# EAGLE design LB_BIT_o3_RGBLED-v02(rev1) (EAGLE 6.2)
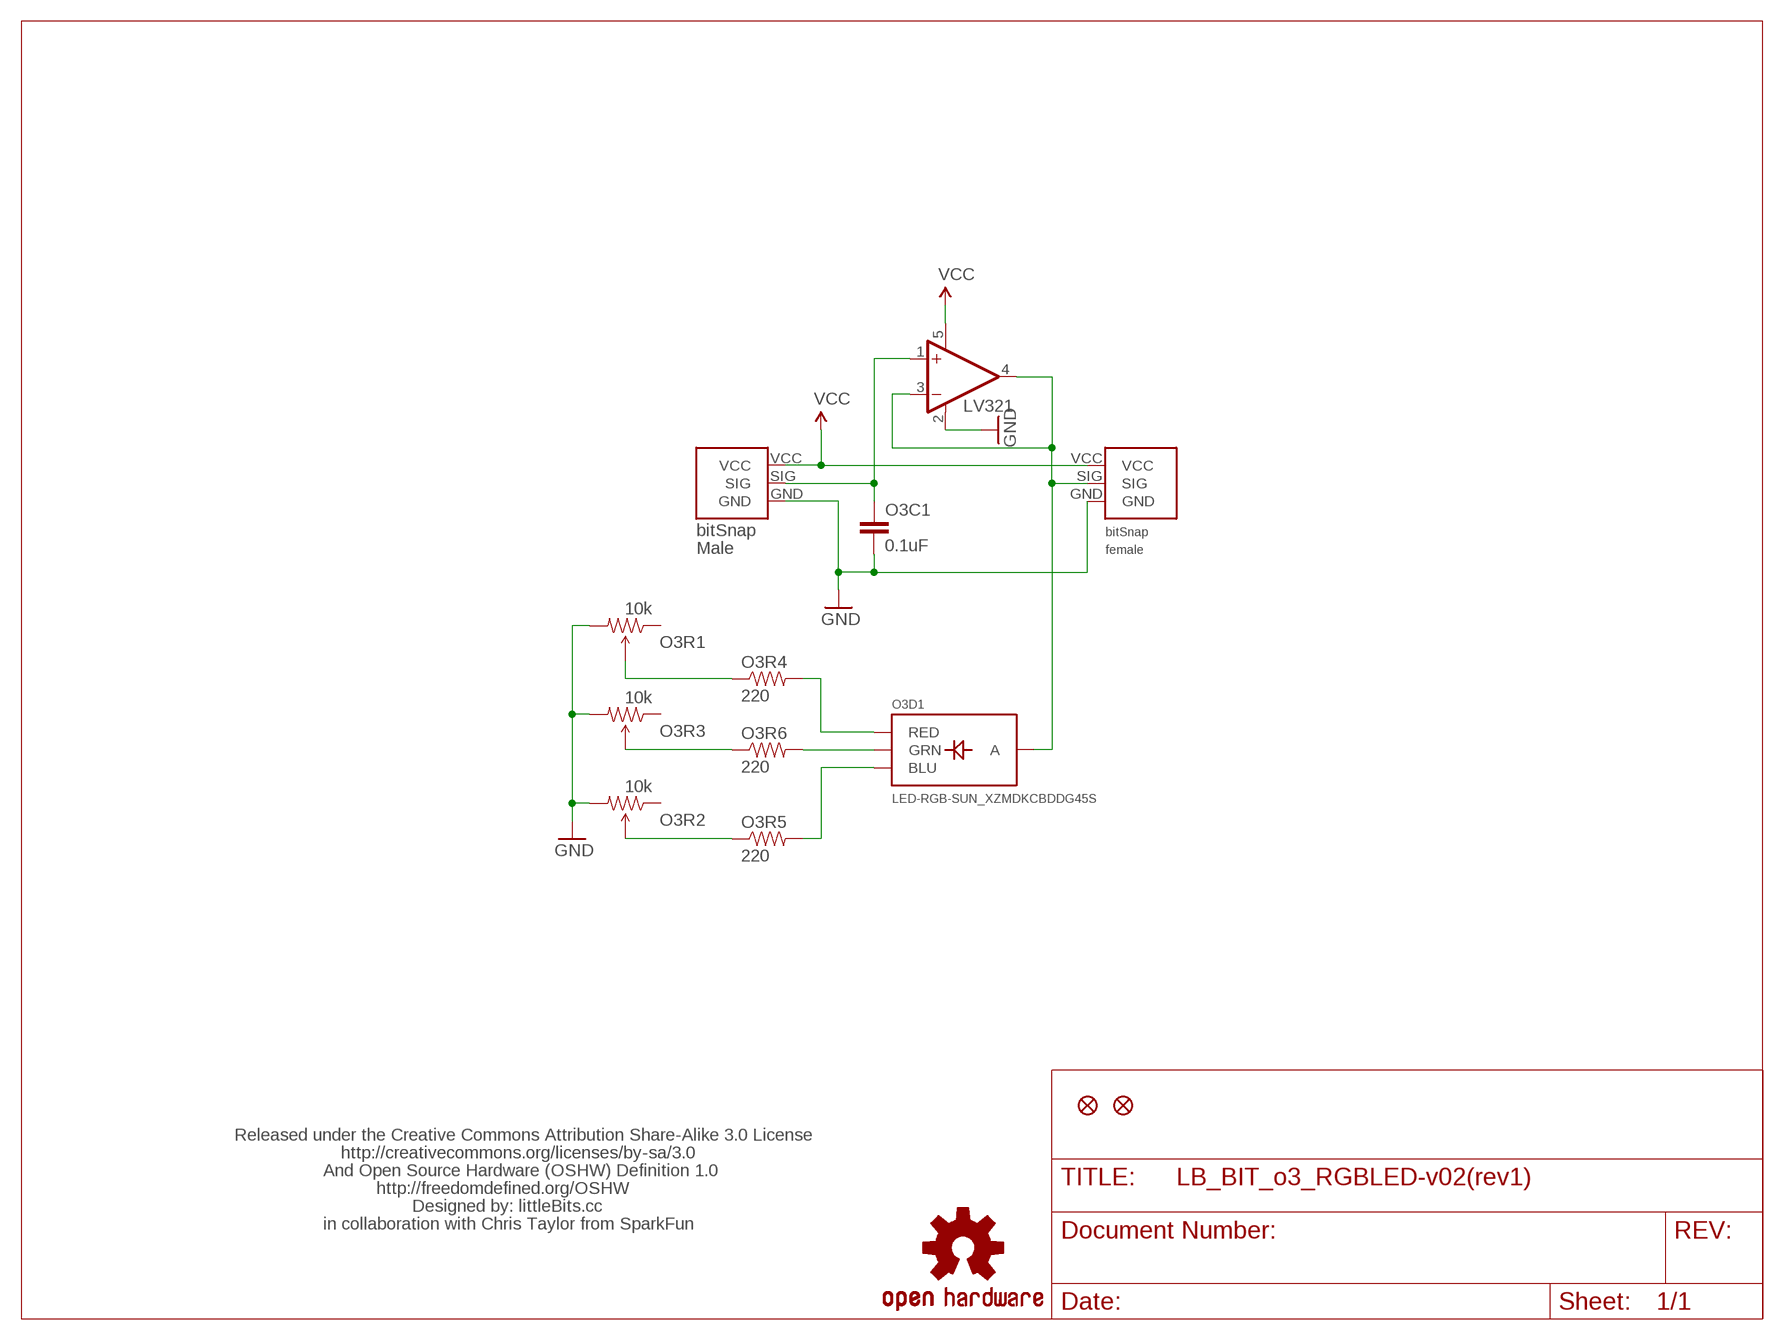
[diagram p0: schematic, sheet 1]

## Parts
JP1  FIDUCIAL1X2.5  [FIDUCIAL-1X2.5]
JP2  FIDUCIAL1X2.5  [FIDUCIAL-1X2.5]
O3BSF  BITSNAP_FEMALE  [BITSNAP_FEMALE]
O3BSM  BITSNAP_MALE  [BITSNAP_MALE]
O3C1  0.1uF  CAP0603-CAP  [0603-CAP]
O3D1  LED-RGB-SUN_XZMDKCBDDG45S  [LED-RGB-SUN_XZMDKCBDDG45S]
O3R1  10k  TRIMPOTSMD  [TRIMPOT-3MM]
O3R2  10k  TRIMPOTSMD  [TRIMPOT-3MM]
O3R3  10k  TRIMPOTSMD  [TRIMPOT-3MM]
O3R4  220  RESISTOR0603-RES  [0603-RES]
O3R5  220  RESISTOR0603-RES  [0603-RES]
O3R6  220  RESISTOR0603-RES  [0603-RES]
O3U1  LV321  [SC70]
U$1  LB_CREDITS  [OSHWCREDIT]
U$5  OSHW-LOGOL  [OSHW-LOGO-L]

## Nets
GND: O3BSF.GND O3BSM.GND O3C1.2 O3R1.3(CW) O3R2.3(CW) O3R3.3(CW) O3U1.2(V-)
LED: O3BSF.SIG O3D1.2(A) O3U1.3(-IN) O3U1.4(OUT)
N$1: O3R1.2(WIPER) O3R4.1
N$2: O3D1.1(RED) O3R4.2
N$3: O3D1.4(GRN) O3R6.2
N$4: O3D1.3(BLU) O3R5.2
N$5: O3R2.2(WIPER) O3R5.1
N$6: O3R3.2(WIPER) O3R6.1
SIG: O3BSM.SIG O3C1.1 O3U1.1(+IN)
VCC: O3BSF.VCC O3BSM.VCC O3U1.5(V+)
Unconnected: O3R1.1(CCW) O3R2.1(CCW) O3R3.1(CCW)

## Library data of the parts
JP1 JP2 = abes:FIDUCIAL: Fiducial Alignment Points Various fiducial points for machine vision alignment.
O3BSF = bitSnap:BITSNAP_FEMALE
O3BSM = bitSnap:BITSNAP_MALE
O3C1 = SparkFun:CAP: Capacitor Standard 0603 ceramic capacitor, and 0.1" leaded capacitor.
O3D1 = LITTLEBITS:LED-RGB-SUN_XZMDKCBDDG45S
O3R1-O3R3 = SparkFun:TRIMPOT
O3R4-O3R6 = SparkFun:RESISTOR: Resistor Basic schematic elements and footprints for 0603, 1206, and PTH 1/10th watt (small) resistors.
O3U1 = LITTLEBITS:LV321
U$1 = LITTLEBITS:LB_CREDITS
U$5 = SparkFun:OSHW-LOGO: Open Source Hardware Logo This logo indicates the piece of hardware it is found on incorporates a OSHW license and/or adheres to the definition of open source hardware found here: http://freedomdefined.org/OSHW

## Board
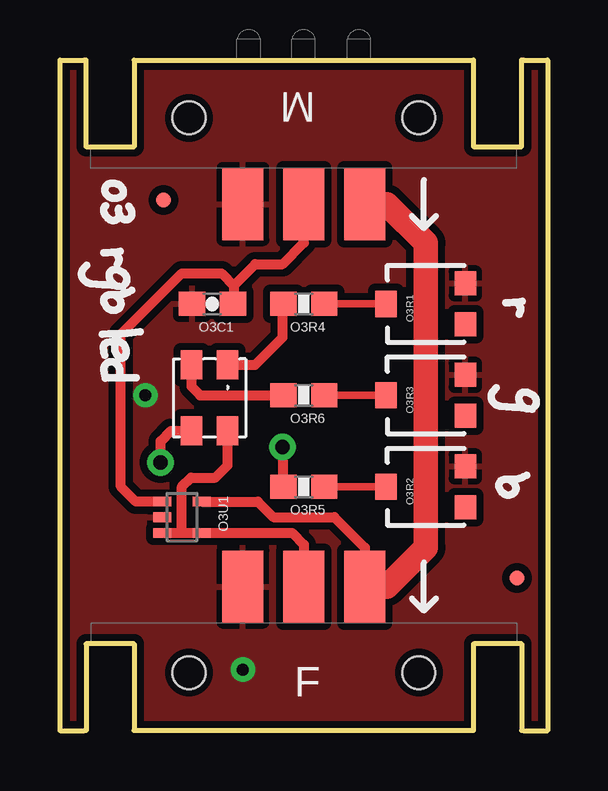
[diagram p1: board, top side]
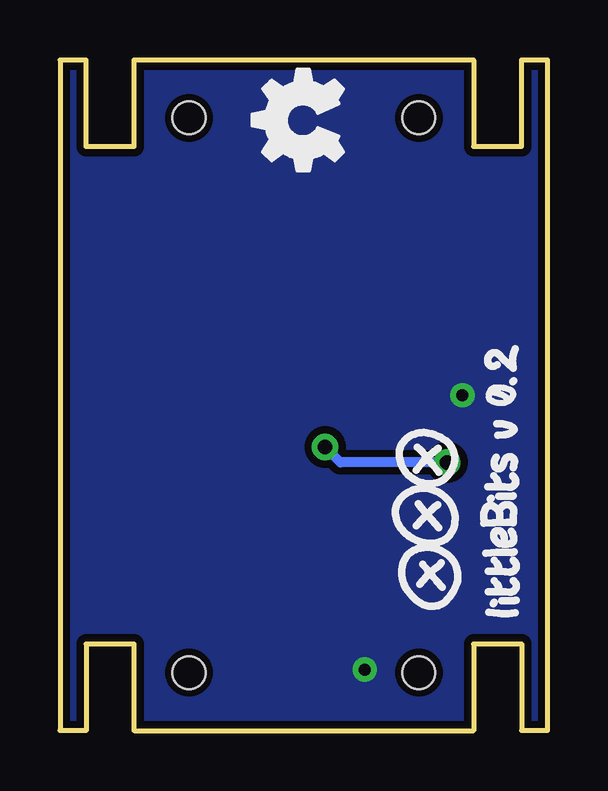
[diagram p2: board, bottom side, seen from below]

Size 20.32 x 27.94 mm. Coordinates in mm from the lower left corner, seen from the top.
Outline: 1.02,27.94 0,27.94 0,0 1.02,0
Outline: 19.3,27.94 20.32,27.94 20.32,0 19.3,0
Copper layers (1*16): Top 0.035mm / dielectric 1.5mm / Bottom 0.035mm
Design rules: minimum track width 8mil, minimum drill 20mil, track to track 8mil, track to pad 8mil, pad to pad 8mil, via to via 8mil, smd to smd 8mil, copper to edge 10mil, drill to drill 8mil, minimum pad ring 12mil, minimum via ring 10mil, stop-mask expansion 4mil, vias tented up to drill 25mil, thermal gap 10mil

### Footprints (pad centres in the part's own frame; a part is rotated, then mirrored left to right if it is on the bottom)
FIDUCIAL-1X2.5 = smd 0.635 x 0.635: 1 0,0
BITSNAP_FEMALE = smd 1.7 x 3: GND 6.35,6; SIG 8.89,6; VCC 11.43,6 | hole 1.37: 13.68,2.41; 4.1,2.41
BITSNAP_MALE = smd 1.7 x 3: GND 11.43,6; SIG 8.89,6; VCC 6.35,6 | hole 1.37: 13.68,2.41; 4.1,2.41
0603-CAP = smd 1.1 x 1: 1 -0.85,0; 2 0.85,0
LED-RGB-SUN_XZMDKCBDDG45S = smd 0.9 x 1.2: 1 0,0; 2 0,2.75; 3 1.5,2.75; 4 1.5,0; 5 1.5,2.75
TRIMPOT-3MM = smd 1 x 0.9: 1 -0.85,-1.65; 3 0.85,-1.65 | smd 1.1 x 0.9: 2 0,1.65
0603-RES = smd 1.1 x 1: 1 -0.85,0; 2 0.85,0
SC70 = smd 0.4 x 0.75: 1 -0.65,-0.825; 2 0,-0.825; 3 0.65,-0.825; 4 0.65,0.825; 5 -0.65,0.825

### Placement (x,y rotation side)
JP1  19.05,6.35 0 top
JP2  4.32,22.1 0 top
O3BSF  1.27,0 0 top
O3BSM  19.05,27.94 180 top
O3C1  6.35,17.78 180 top
O3D1  6.99,15.24 180 top
O3R1  15.24,17.78 90 top
O3R2  15.24,10.16 90 top
O3R3  15.24,13.97 90 top
O3R4  10.16,17.78 180 top
O3R5  10.16,10.16 180 top
O3R6  10.16,13.97 180 top
O3U1  5.08,8.89 270 top
U$1  7.62,-17.78 0 top  (outside the outline)
U$2  [LB_V02]  0,3.81 0 top
U$5  -13.97,-10.16 0 top  (outside the outline)
U$6  [OSHW_FILLX150_NOTEXT]  8.51,22.48 0 top

### Tracks (layer width: path | path; a pad name or v marks a point on that pad's centre or on a via)
GND  (via drill 0.51)
  other vias: 3.56,13.97 7.62,2.54
  pour Top (isolate 0.305): 0,27.94 0,0 20.32,0 20.32,27.94
  pour Bottom (isolate 0.305): 0,27.94 0,0 20.32,0 20.32,27.94
LED
  Top 0.406: O3BSF.SIG 10.16,7.75 9.67,8.24 O3U1.4 5.08,8.24 | O3D1.2 6.99,11.05 6.48,10.54 5.46,10.54 5.08,10.16 5.08,8.24 | O3U1.3 5.08,8.24
N$1
  Top 0.305: O3R4.1 O3R1.2
N$2
  Top 0.406: O3D1.1 8.13,15.24 9.27,16.38 9.27,17.74 O3R4.2
N$3
  Top 0.406: O3D1.4 5.49,14.33 5.84,13.97 O3R6.2
N$4  (via drill 0.6)
  Top 0.406: v9.27,11.81 9.27,10.2 O3R5.2 | O3D1.3 4.62,12.49 4.19,12.06 v4.19,11.18
  Bottom 0.406: v4.19,11.18 8.64,11.18 v9.27,11.81
N$5
  Top 0.305: O3R5.1 O3R2.2
N$6
  Top 0.305: O3R6.1 O3R3.2
SIG
  Top 0.305: 7.24,17.82 O3C1.1
  Top 0.406: O3BSM.SIG 10.16,20.32 9.27,19.43 8.13,19.43 7.24,18.54 | 7.24,18.54 7.24,17.82 | 7.24,18.54 6.73,19.05 5.08,19.05 2.54,16.51 2.54,10.16 3.16,9.54 O3U1.1
VCC
  Top 0.406: O3BSF.VCC 12.7,7.62 11.43,8.89 8.89,8.89 8.24,9.54 O3U1.5
  Top 1.016: O3BSM.VCC 13.62,21.94 15.24,20.32 15.24,7.62 13.62,6 O3BSF.VCC